# EAGLE schematic qcdo_layout_v1 (EAGLE 7.2.0)
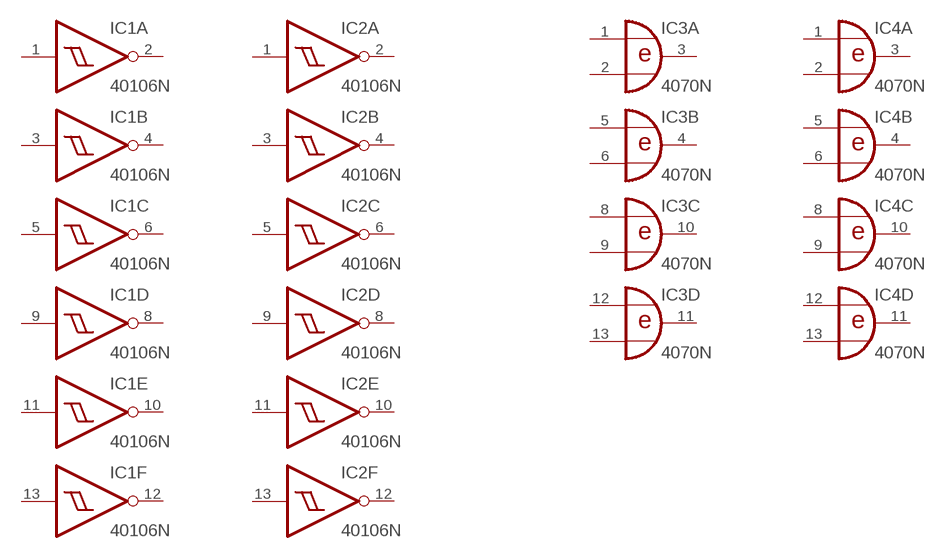
[diagram p0: schematic, sheet 1]

## Parts
IC1  40106N  [DIL14]
IC2  40106N  [DIL14]
IC3  4070N  [DIL14]
IC4  4070N  [DIL14]
Unconnected: IC1.1(A:I) IC1.2(A:O) IC1.3(B:I) IC1.4(B:O) IC1.5(C:I) IC1.6(C:O) IC1.8(D:O) IC1.9(D:I) IC1.10(E:O) IC1.11(E:I) IC1.12(F:O) IC1.13(F:I) IC2.1(A:I) IC2.2(A:O) IC2.3(B:I) IC2.4(B:O) IC2.5(C:I) IC2.6(C:O) IC2.8(D:O) IC2.9(D:I) IC2.10(E:O) IC2.11(E:I) IC2.12(F:O) IC2.13(F:I) IC3.1(A:I0) IC3.2(A:I1) IC3.3(A:O) IC3.4(B:O) IC3.5(B:I0) IC3.6(B:I1) IC3.8(C:I0) IC3.9(C:I1) IC3.10(C:O) IC3.11(D:O) IC3.12(D:I0) IC3.13(D:I1) IC4.1(A:I0) IC4.2(A:I1) IC4.3(A:O) IC4.4(B:O) IC4.5(B:I0) IC4.6(B:I1) IC4.8(C:I0) IC4.9(C:I1) IC4.10(C:O) IC4.11(D:O) IC4.12(D:I0) IC4.13(D:I1)

## Power pins joined to a net without a drawn wire
VDD: IC1.14(P:VDD) IC2.14(P:VDD) IC3.14(P:VDD) IC4.14(P:VDD)
VSS: IC1.7(P:VSS) IC2.7(P:VSS) IC3.7(P:VSS) IC4.7(P:VSS)

## Library data of the parts
IC1 IC2 = 40xx:40106: Hex SCHMITT TRIGGER
IC3 IC4 = 40xx:4070: Quad 2-input XOR